# Altium schematic sheet RC Reciever Backend.SchDoc
size A; SheetNumber: 2; SheetTotal: 2
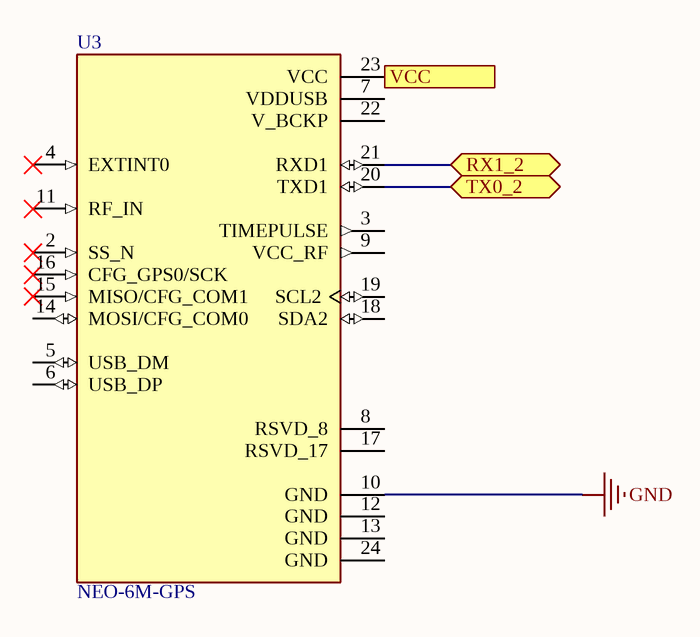
[diagram p0: RC Reciever Backend.SchDoc]

## Parts
U3  NEO-6M-GPS  [XCVR_NEO-6M-GPS]

## Ports
RX1_2 (bidir, see RC Reciever SchDoc[3C]), TX0_2 (bidir, see RC Reciever SchDoc[3C]), VCC (see RC Reciever SchDoc[3B])

## Nets
GND: U3.10(GND)
RX1_2: U3.21(RXD1) ; port RX1_2
TX0_2: U3.20(TXD1) ; port TX0_2
VCC: U3.23(VCC) ; port VCC

Not connected (* = marked no-connect by the designer): U3 2(SS_N)* 3(TIMEPULSE) 4(EXTINT0)* 5(USB_DM) 6(USB_DP) 7(VDDUSB) 8(RSVD_8) 9(VCC_RF) 11(RF_IN)* 12(GND) 13(GND) 14(MOSI/CFG_COM0) 15(MISO/CFG_COM1)* 16(CFG_GPS0/SCK)* 17(RSVD_17) 18(SDA2) 19(SCL2) 22(V_BCKP) 24(GND)

## Library data of the parts
U3 = NEO-6M-GPS: GPS Development Tools SparkFun GNSS-RTK Dead Reckoning Breakout - ZED-F9K (Qwiic); MF: u-blox; SnapEDA_Link: https://www.snapeda.com/parts/NEO-6M-GPS/u-blox/view-part/?ref=snap; MP: NEO-6M-GPS; Availability: Not in stock; Price: None; Check_prices: https://www.snapeda.com/parts/NEO-6M-GPS/u-blox/view-part/?ref=eda; Value: *; Package: None